# Altium schematic sheet Gyro.SchDoc: MPU-6000 Gyro
size A4; Author: Miłosz Werner & Julia Rzepka; DrawnBy: Miłosz Werner; Organization: Wroclaw University of Science and Technology; DocumentNumber: 1; Revision: 1.0; SheetNumber: 2; SheetTotal: 9
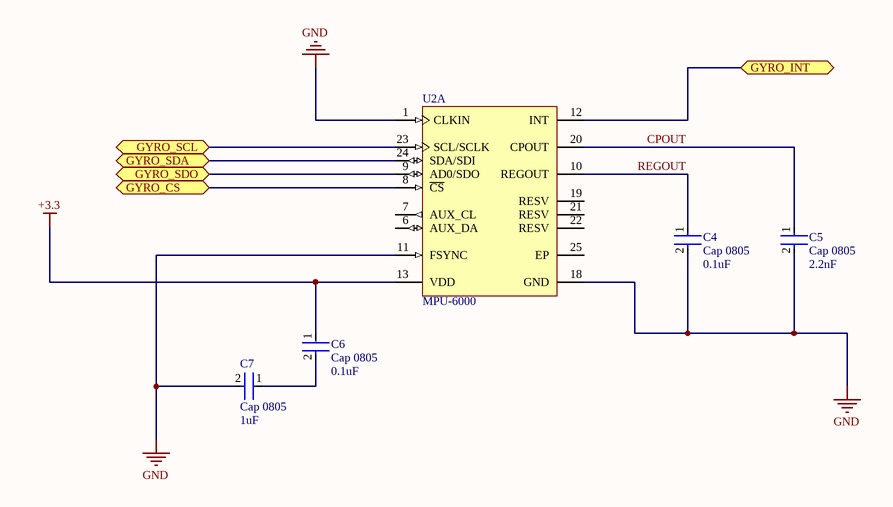
[diagram p0: Gyro.SchDoc]

## Parts
C4  Cap 0805  value 0.1uF  [FP-GRM216-0_1-IPC_C]
C5  Cap 0805  value 2.2nF  [FP-GRM216-0_1-IPC_C]
C6  Cap 0805  value 0.1uF  [FP-GRM216-0_1-IPC_C]
C7  Cap 0805  value 1uF  [FP-GRM216-0_1-IPC_C]
U2  MPU-6000  [INSE-QFN-24_V]  (part A of 2)

## Ports
GYRO_CS (bidir), GYRO_INT (bidir), GYRO_SCL (bidir), GYRO_SDA (bidir), GYRO_SDO (bidir)

## Nets
+3.3: C6.1 U2.13(VDD)
GND: C4.2 C5.2 C7.2 U2.1(CLKIN) U2.11(FSYNC) U2.18(GND)
CPOUT: C5.1 U2.20(CPOUT)
GYRO_CS: U2.8(~{CS}) ; port GYRO_CS
GYRO_INT: U2.12(INT) ; port GYRO_INT
GYRO_SCL: U2.23(SCL/SCLK) ; port GYRO_SCL
GYRO_SDA: U2.24(SDA/SDI) ; port GYRO_SDA
GYRO_SDO: U2.9(AD0/SDO) ; port GYRO_SDO
REGOUT: C4.1 U2.10(REGOUT)
NetC6_2: C6.2 C7.1

Not connected (* = marked no-connect by the designer): U2 6(AUX_DA) 7(AUX_CL) 19(RESV) 21(RESV) 22(RESV) 25(EP)

## Library data of the parts
C4-C7 = CMP-2007-00889-2: Capacitor; Capacitance: 100nF; Mount: Surface Mount; Case/Package: 0805; Case Code (Imperial): 0805
U2 = CMP-2000-05008-1: 3-Axis Gyroscope 3-Axis Accelerometer Motion Processing Unit with I2C and SPI, 2.5, 3 or 3.3 V, -40 to 85 degC, 24-Pin QFN, RoHS, Tape and Reel; Manufacturer: InvenSense; Featured Product: MPU60006AxisIntegratedSPISolution; Output Type: I²C,SPI; Sensor Type: Accelerometer,Gyroscope,3Axis; Other Names: 1428-1005-2 / MPU6000; Online Catalog: MPU-6000™Series; Operating Temperature: -40degC~85degC(TA); Datasheet URL: https://www.invensense.com/wp-content/uploads/2015/02/MPU-6000-Datasheet1.pdf; Manufacturer URL: http://www.invensense.com/; Datasheet Version: Rev. 3.4, 08/2013; Standard Package: 5,000; Family: Multifunction; Package Reference: QFN-24; Category: Sensors,Transducers; Package Description: 24-Pin Quad Flat No-lead Package, Body 4 x 4 mm, Pitch 0.5 mm